# Altium schematic sheet motordriver-v5.0_current_amplification.SchDoc
size A4; SheetNumber: 10; SheetTotal: 10
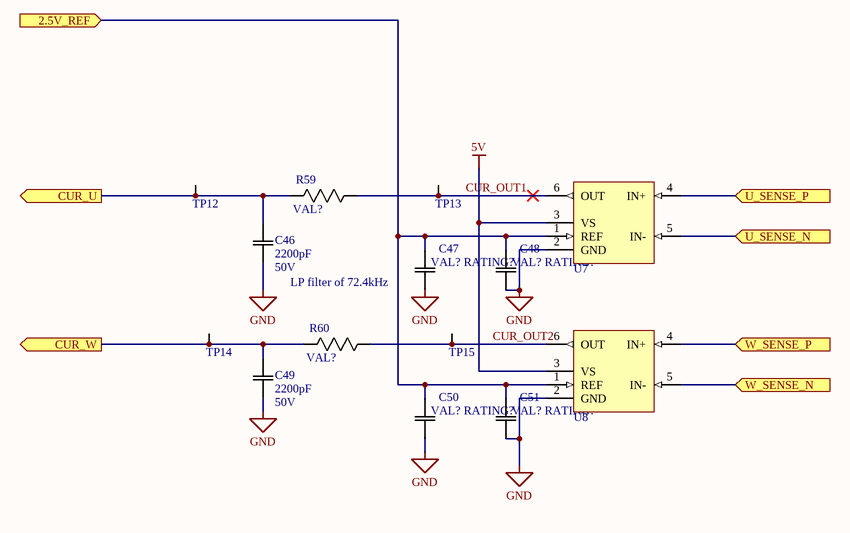
[diagram p0: motordriver-v5.0_current_amplification.SchDoc]

## Parts
C46  value 2200pF  Rating: 50V  [0603]  (hidden comment: VAL? RATING?)
C47  VAL? RATING?  [0603]
C48  VAL? RATING?  [0603]
C49  value 2200pF  Rating: 50V  [0603]  (hidden comment: VAL? RATING?)
C50  VAL? RATING?  [0603]
C51  VAL? RATING?  [0603]
R59  VAL?  [0603]
R60  VAL?  [0603]
TP12  Test Point (Via)  [TP]  (value not drawn)
TP13  Test Point (Via)  [TP]  (value not drawn)
TP14  Test Point (Via)  [TP]  (value not drawn)
TP15  Test Point (Via)  [TP]  (value not drawn)
U7  OP AMP CURR SENSE BI TSC  [SC70-6]  (value not drawn)
U8  OP AMP CURR SENSE BI TSC  [SC70-6]  (value not drawn)

## Ports
2.5V_REF (in), CUR_U (out), CUR_W (out), U_SENSE_N (in), U_SENSE_P (in), W_SENSE_N (in), W_SENSE_P (in)

## Nets
5V: U7.3(VS) U8.3(VS)
GND: C46.1(C1) C47.1(C1) C48.1(C1) C49.1(C1) C50.1(C1) C51.1(C1) U7.2(GND) U8.2(GND)
2.5V_REF: C47.2(C2) C48.2(C2) C50.2(C2) C51.2(C2) U7.1(REF) U8.1(REF) ; port 2.5V_REF
CUR_OUT1: R59.1(R1) TP13.1 U7.6(OUT)
CUR_OUT2: R60.1(R1) TP15.1 U8.6(OUT)
CUR_U: C46.2(C2) R59.2(R2) TP12.1 ; port CUR_U
CUR_W: C49.2(C2) R60.2(R2) TP14.1 ; port CUR_W
U_SENSE_N: U7.5(IN-) ; port U_SENSE_N
U_SENSE_P: U7.4(IN+) ; port U_SENSE_P
W_SENSE_N: U8.5(IN-) ; port W_SENSE_N
W_SENSE_P: U8.4(IN+) ; port W_SENSE_P

## Notes on the sheet
- (near C47) LP filter of 72.4kHz

## Library data of the parts
C46 C49 = CAP 2200pF 50V: Default Symbol for Capacitors; Manufacturer Part Number 1: 06035C222KAT2A; Tolerance: 10%; Temperature Coefficient: X7R; Part Number: CAP 2200pF 50V; Supplier 1: Digi-Key; Supplier Part Number 1: 478-1219-1-ND; Manufacturer Part Number 2: CL21B222KBANNNC; Supplier 2: Digi-Key; Supplier Part Number 2: 1276-1171-1-ND
C47 C48 C50 C51 = CAP 100nF 50V: Default Symbol for Capacitors; Manufacturer Part Number 1: CC0603KPX7R9BB104; Value: 100nF; Tolerance: 10%; Rating: 50V; Temperature Coefficient: X7R; Part Number: CAP 100nF 50V; Supplier 1: Digi-Key; Supplier Part Number 1: 311-3567-1-ND; Manufacturer Part Number 2: 0805J0500104KJT; Supplier 2: Digi-Key; Supplier Part Number 2: 1608-1458-1-ND
R59 R60 = RES 1k 1/8W - 1%: Default Resistor Symbol; Manufacturer Part Number 1: MCT06030C1001FP500; Value: 1k; Power (Watts): 0.125W; Tolerance: 1%; Package: 0805; Part Number: RES 1k 1/8W - 1%; Supplier 1: Digi-Key; Supplier Part Number 1: MCT0603-1.00K-CFCT-ND; Manufacturer Part Number 2: RMCF0805FT1K00; Supplier 2: Digi-Key; Supplier Part Number 2: RMCF0805FT1K00CT-ND; Tolerance 2: 1%
U7 U8 = OP AMP CURR SENSE BI TSC: SP Amp Current Sense Amp Single R-R O/P 5.5V Automotive 6-Pin SC-70 T/R; Manufacturer Part Number: TSC214ICT; Supplier 1: Digi-Key; Supplier Part Number 1: 497-TSC214ICT-ND; Part Number: OP AMP CURR SENSE BI TSC; Suppler URL 1: https://www.digikey.ca/en/products/detail/stmicroelectronics/TSC214ICT/14291430?s=N4IgTCBcDaICwE4DsBaAKgZQMJgIxwEks0UA5AERAF0BfIA
TP12-TP15 = Test Point (Via): Part Number: Test Point (Via)